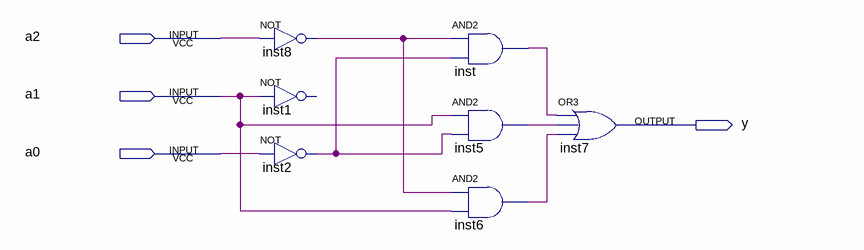
[diagram p0: schematic sheet]
// Quartus schematic laba5.bdf as structural Verilog: 7 symbols, 4 pins
module laba5 (
  input  a2,
  input  a1,
  input  a0,
  output y
);

  wire inst2_out, inst5_out, inst6_out, inst8_out, inst_out;

  not inst8 (inst8_out, a2);
  // NOT inst1 has open pins: IN=a1, OUT=open
  not inst2 (inst2_out, a0);
  and inst (inst_out, inst8_out, inst2_out);
  and inst5 (inst5_out, a1, inst2_out);
  and inst6 (inst6_out, inst8_out, a1);
  or inst7 (y, inst_out, inst5_out, inst6_out);
endmodule
